# Altium schematic sheet Main.SchDoc
size A4
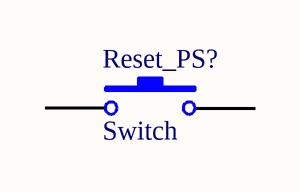
[diagram p0: Main.SchDoc]

## Parts
Reset_PS?  Switch  [B3FS]

## Nets

Not connected (* = marked no-connect by the designer): Reset_PS? 1 2

## Library data of the parts
Reset_PS? = CMP-00077-A.5: SW B3FS-1002; Manufacturer: Omron; RS: 6866821; Manufacturer ID: B3FS-1002; Farnell: 3121173; DigiKey: SW1236-ND; Mouser: 653-B3FS-1002; Type: SMD